# EAGLE schematic Battery Detector v1.0 (EAGLE 6.4)
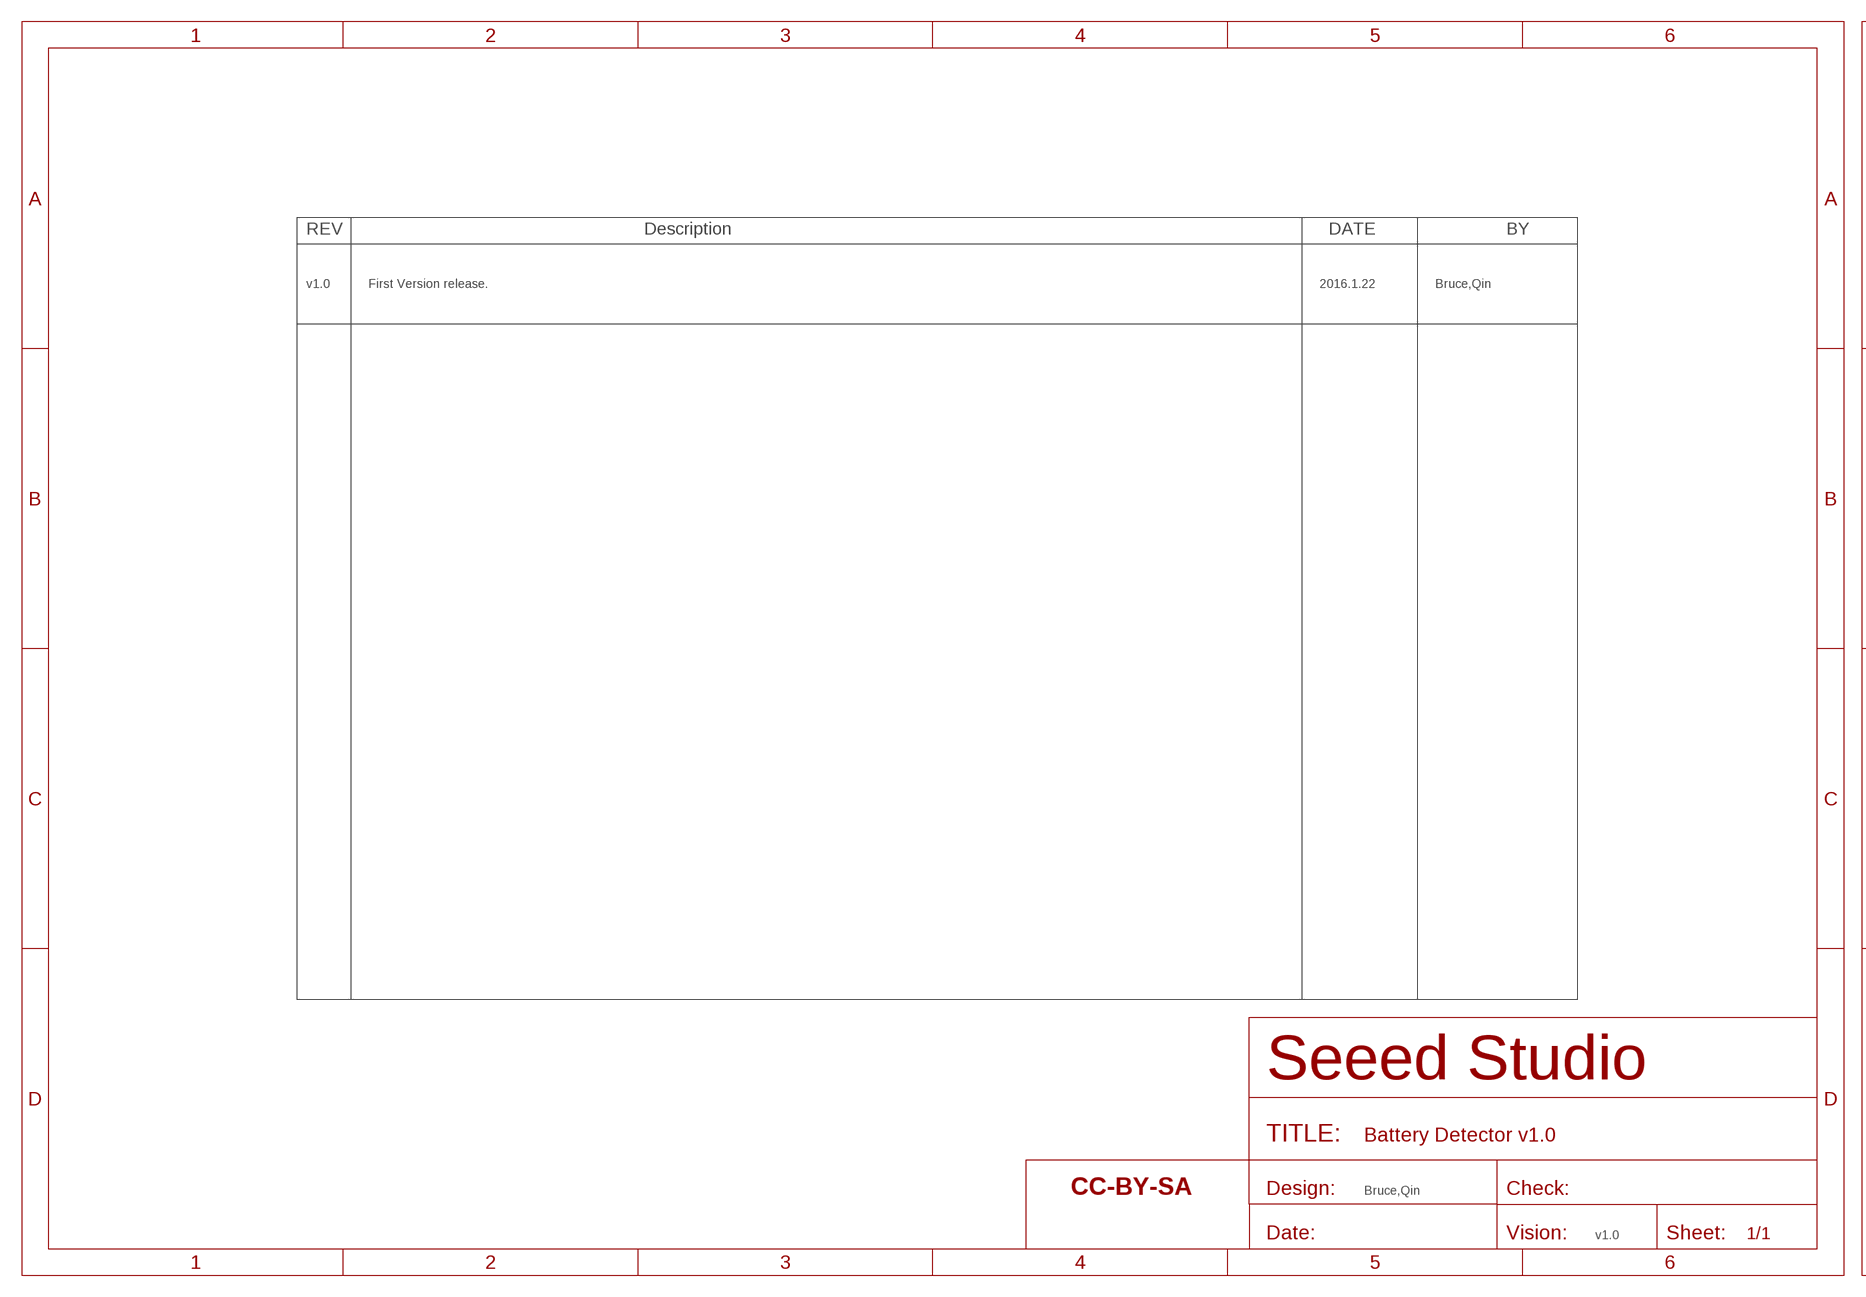
[diagram p0: schematic, sheet 1, part 1 of 2]
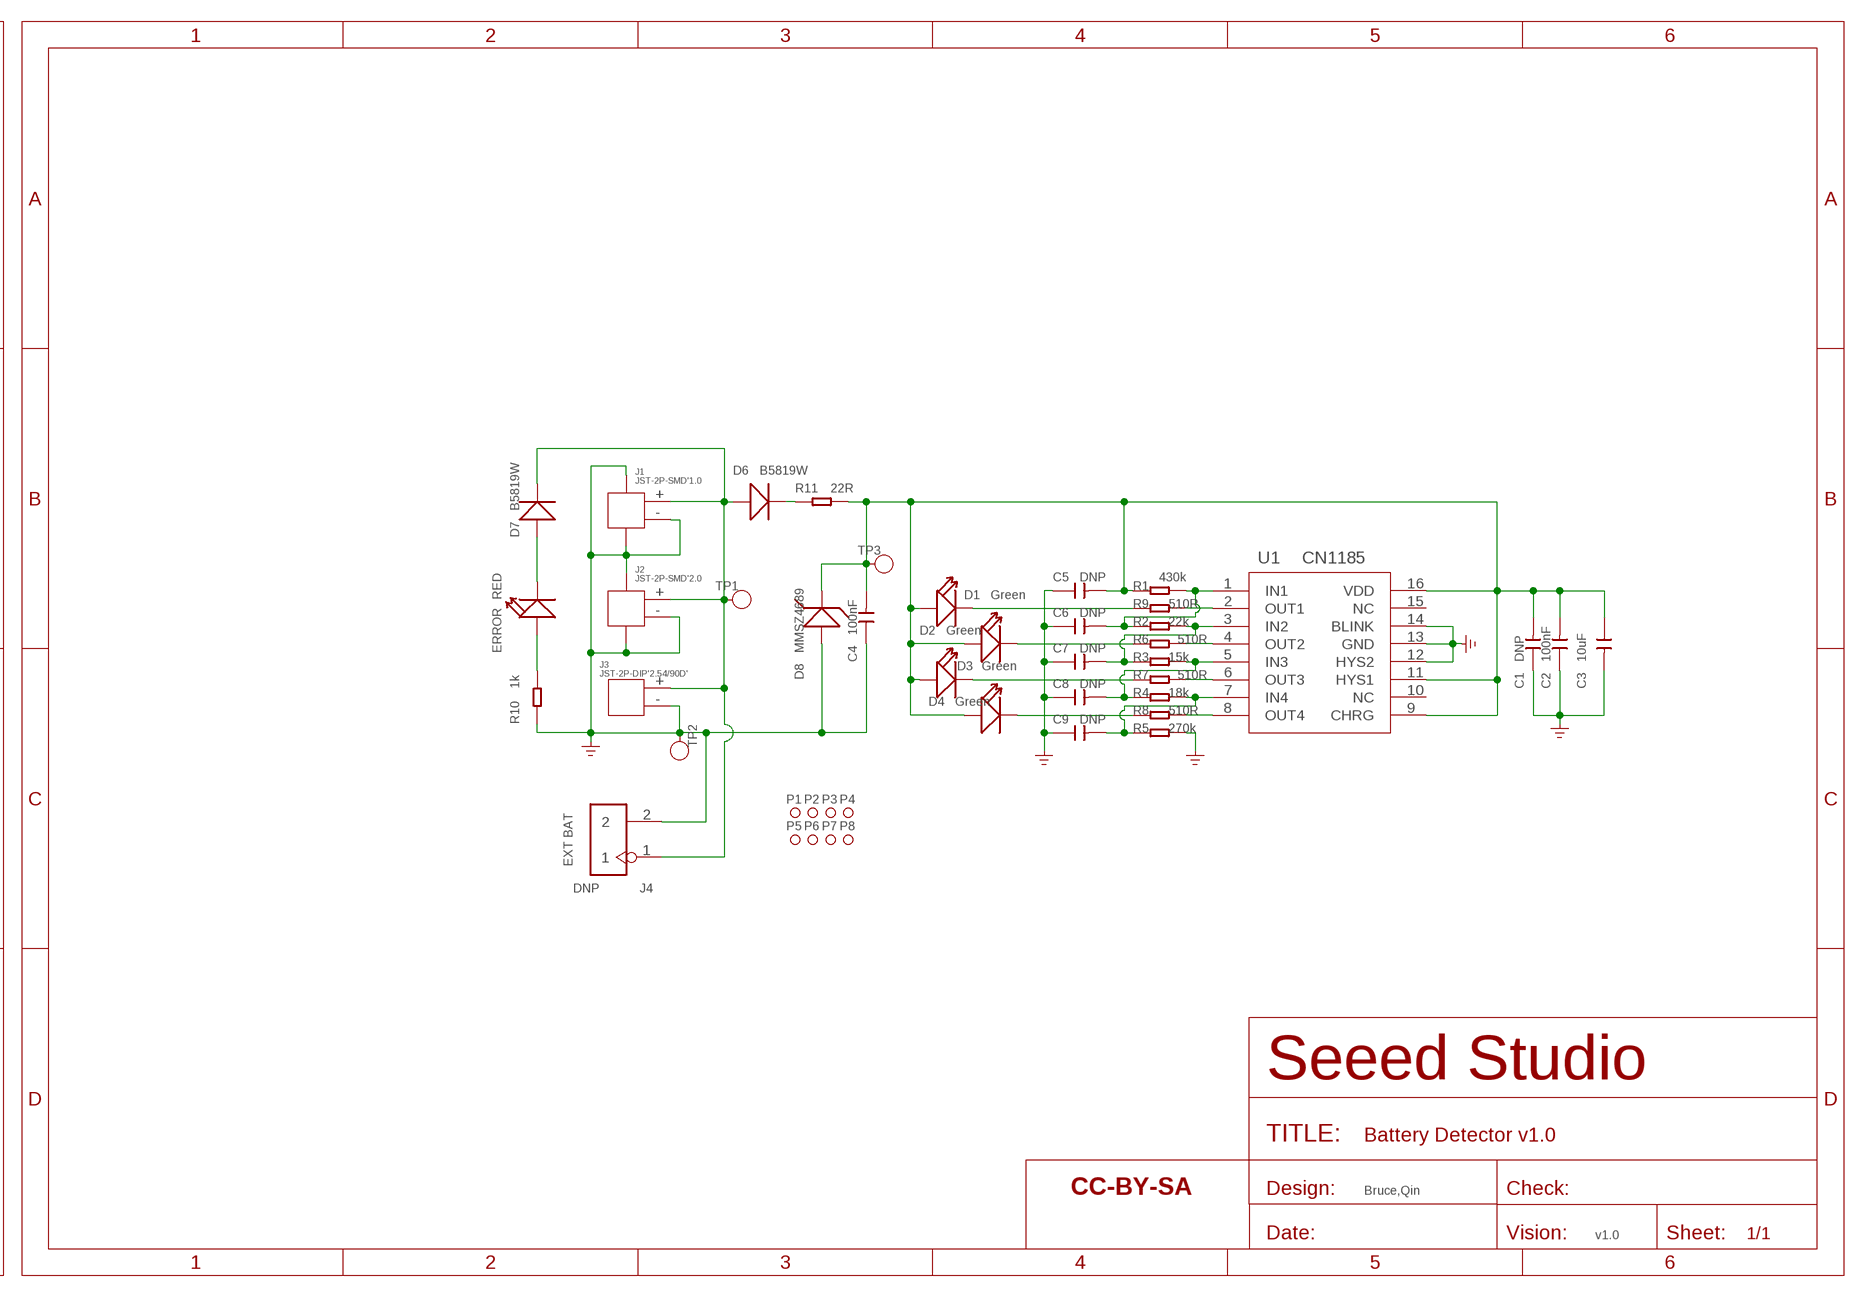
[diagram p1: schematic, sheet 1, part 2 of 2]

## Parts
C1  DNP  CAP-0603  [C0603]
C2  100nF  CAP-0603  [C0603]
C3  10uF  CAP-0805  [C0805]
C4  100nF  CAP-0603  [C0603]
C5  DNP  CAP-0603  [C0603]
C6  DNP  CAP-0603  [C0603]
C7  DNP  CAP-0603  [C0603]
C8  DNP  CAP-0603  [C0603]
C9  DNP  CAP-0603  [C0603]
D1  Green  LED'0603'  [LED-0603]
D2  Green  LED'0603'  [LED-0603]
D3  Green  LED'0603'  [LED-0603]
D4  Green  LED'0603'  [LED-0603]
D6  B5819W  DIODE'1206'  [SOD-123]
D7  B5819W  DIODE'1206'  [SOD-123]
D8  MMSZ4689  D-ZENER-2P'MMSZ4689-V'  [SOD-123]
ERROR  RED  LED'0603'  [LED-0603]
FR1  SEEEDSTUDIO-OPEN-SCH-FRAME  [SEEEDSTUDIO-PCB-FRAME]
FR2  SEEEDSTUDIO-OPEN-SCH-FRAME  [SEEEDSTUDIO-PCB-FRAME]
J1  JST-2P-SMD'1.0  JST-2P-SMD'1.0'  [HW2-SMD-1.0-90D]
J2  JST-2P-SMD'2.0  JST-2P-SMD'2.0'  [HW2-SMD-2.0-90D]
J3  JST-2P-DIP'2.54/90D'  [JST2-2.54-90D]
J4  DNP  HEADER-2P-65/35MIL  [H2-2.54]
P1  MARK-1.0'ANNULAR'  [ROUND-MARK-1.0]
P2  MARK-1.0'ANNULAR'  [ROUND-MARK-1.0]
P3  MARK-1.0'ANNULAR'  [ROUND-MARK-1.0]
P4  MARK-1.0'ANNULAR'  [ROUND-MARK-1.0]
P5  MARK-1.0'ANNULAR'  [ROUND-MARK-1.0]
P6  MARK-1.0'ANNULAR'  [ROUND-MARK-1.0]
P7  MARK-1.0'ANNULAR'  [ROUND-MARK-1.0]
P8  MARK-1.0'ANNULAR'  [ROUND-MARK-1.0]
R1  430k  RES-0603  [R0603]
R2  22k  RES-0603  [R0603]
R3  15k  RES-0603  [R0603]
R4  18k  RES-0603  [R0603]
R5  270k  RES-0603  [R0603]
R6  510R  RES-0603  [R0603]
R7  510R  RES-0603  [R0603]
R8  510R  RES-0603  [R0603]
R9  510R  RES-0603  [R0603]
R10  1k  RES-0603  [R0603]
R11  22R  RES-0805  [R0805]
TP1  DNP  TEST-POINT'4545'  [TP-D45MIL]
TP2  DNP  TEST-POINT'4545'  [TP-D45MIL]
TP3  DNP  TEST-POINT'4545'  [TP-D45MIL]
U1  CN1185  [TSSOP16-0.65-5X4.4MM]

## Nets
GND: C1.1 C2.1 C3.2 C4.1 C5.1 C6.1 C7.1 C8.1 C9.1 D8.+ J1.3 J1.4 J1.- J2.3 J2.4 J2.- J3.- J4.2 R5.1 R10.2 TP2.T U1.12(HYS2) U1.13(GND) U1.14(BLINK) ; supply symbol labelled GND_POWER
N$1: R7.1 U1.6(OUT3)
N$2: D6.- R11.2
N$3: C6.2 R1.1 R2.2 U1.1(IN1)
N$4: C7.2 R2.1 R3.2 U1.3(IN2)
N$5: C8.2 R3.1 R4.2 U1.5(IN3)
N$6: R9.1 U1.2(OUT1)
N$7: R6.1 U1.4(OUT2)
N$8: R8.1 U1.8(OUT4)
N$9: D6.+ D7.- J1.+ J2.+ J3.+ J4.1 TP1.T
N$10: D1.- R9.2
N$11: C9.2 R4.1 R5.2 U1.7(IN4)
N$12: D2.- R6.2
N$14: D3.- R7.2
N$16: D4.- R8.2
N$17: ERROR.+ R10.1
N$18: D7.+ ERROR.-
VCC: C1.2 C2.2 C3.1 C4.2 C5.2 D1.+ D2.+ D3.+ D4.+ D8.- R1.2 R11.1 TP3.T U1.9(CHRG) U1.11(HYS1) U1.16(VDD)
Unconnected: U1.10(NC) U1.15(NC)

## Notes on the sheet
- v1.0 | First Version release. | 2016.1.22 | Bruce,Qin
- EXT BAT
- Bruce,Qin | Bruce,Qin
- v1.0 | v1.0

## Library data of the parts
C1-C9 = Discrete-new:CAP: Ceramic Capacitors
D1-D4 ERROR = Discrete-new:LED
D6 D7 = Discrete-new:DIODE*
D8 = Discrete-new:D-ZENER-2P: SOD-123:304030008;SOT-23:304030000
FR1 FR2 = moudle-new:SEEEDSTUDIO-OPEN-SCH-FRAME
J1 J2 = Connector-new:JST-2P-SMD: 2P-SMD-1.0-90D:320110054;2P-SMD-2.0-90D:320110026
J3 = Connector-new:JST-2P-DIP: 2P-2.0:320110049;2P-2.0-90D:320110027;2P-2.54:320110053;2P-2.54-90D:320110000
J4 = Connector-new:HEADER-2P
P1-P8 = Discrete-new:MARK-1.0; PARTNO: DNP
R1-R11 = Discrete-new:RES
TP1-TP3 = Discrete-new:TEST-POINT
U1 = template:CN1185: 低功耗四通道电压检测集成电路; MPN: CN1185